# EAGLE design ChromDot_Ring_two_inch (EAGLE 9.1.0)
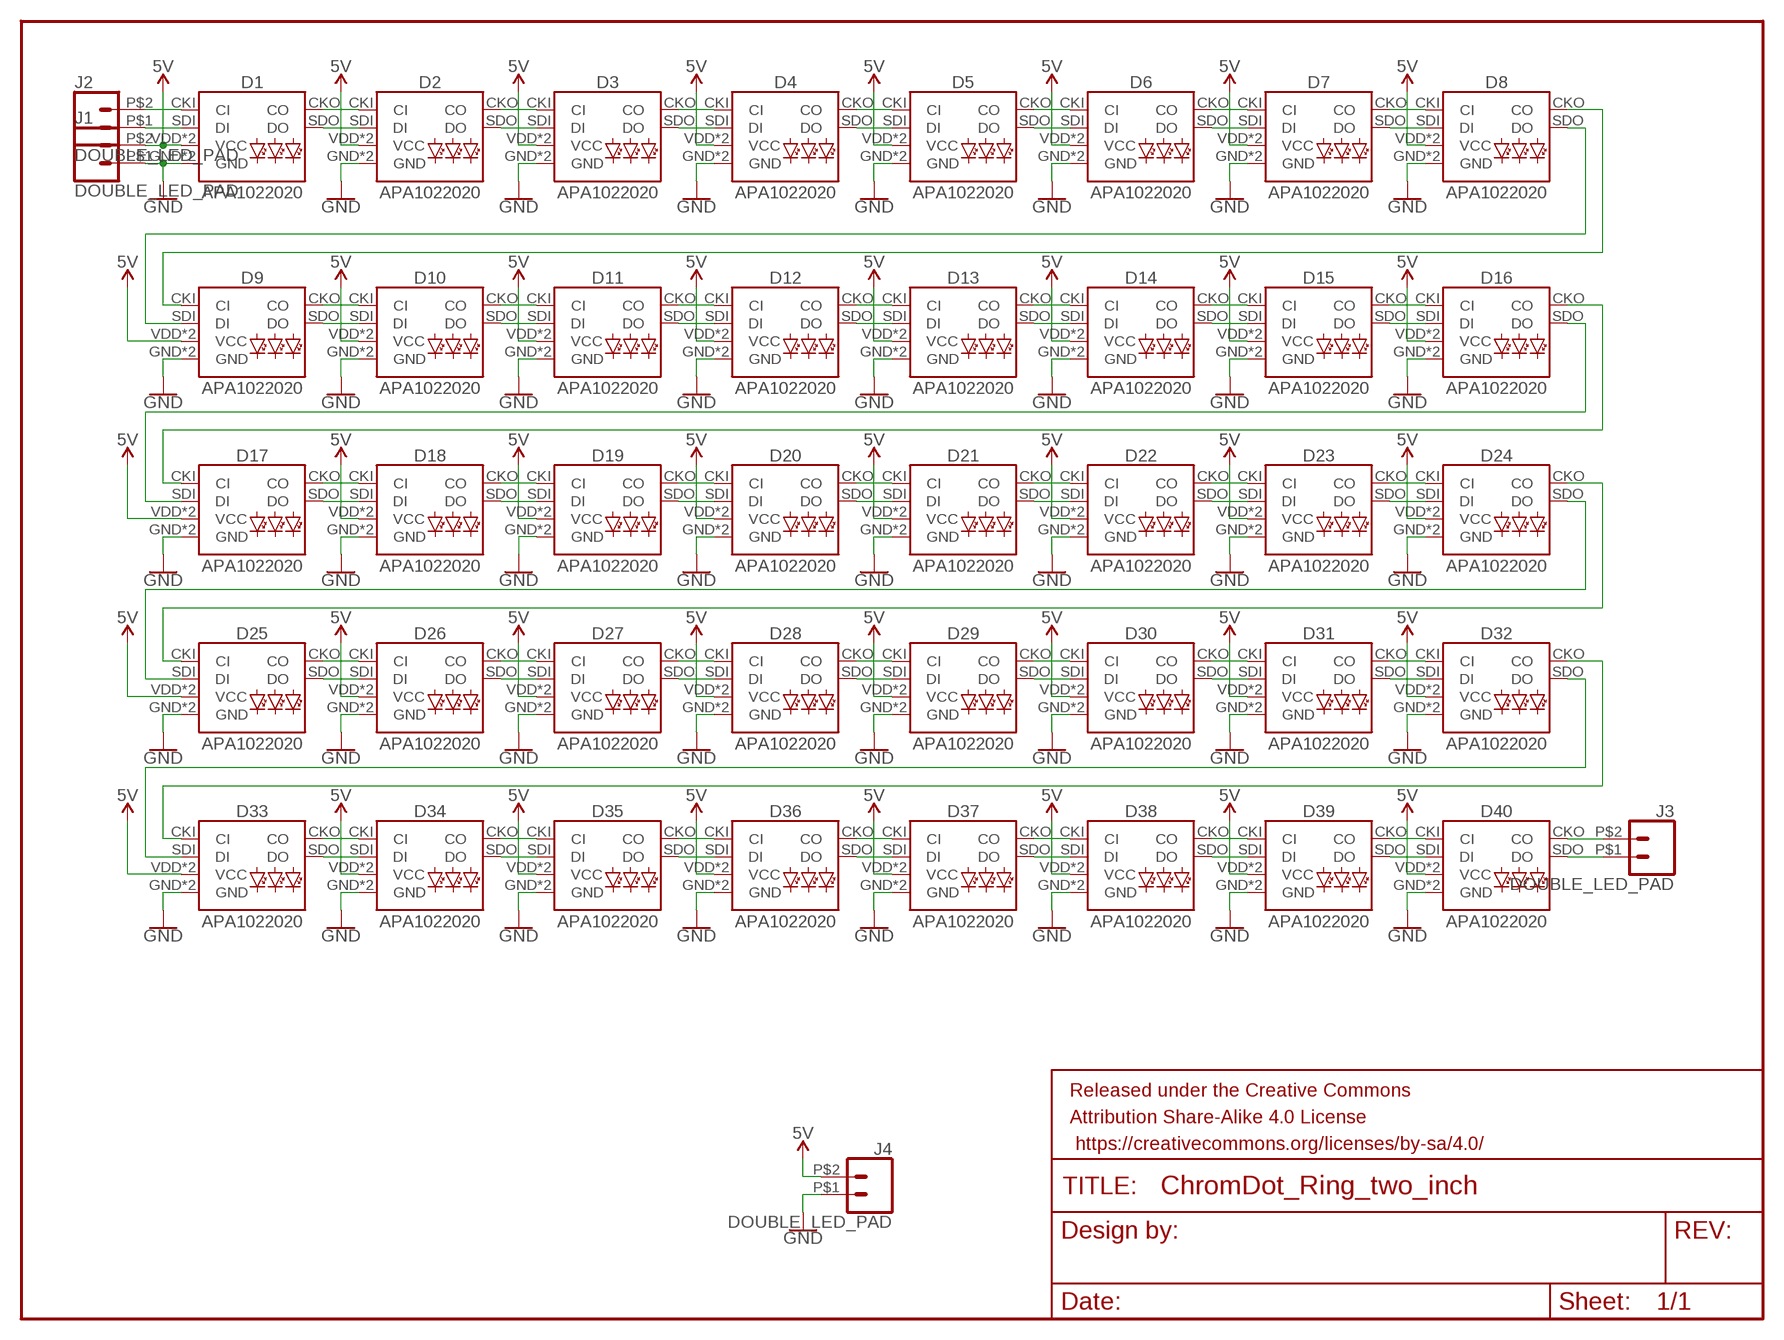
[diagram p0: schematic, sheet 1]

## Parts
D1  APA1022020  [APA102-2020]
D2  APA1022020  [APA102-2020]
D3  APA1022020  [APA102-2020]
D4  APA1022020  [APA102-2020]
D5  APA1022020  [APA102-2020]
D6  APA1022020  [APA102-2020]
D7  APA1022020  [APA102-2020]
D8  APA1022020  [APA102-2020]
D9  APA1022020  [APA102-2020]
D10  APA1022020  [APA102-2020]
D11  APA1022020  [APA102-2020]
D12  APA1022020  [APA102-2020]
D13  APA1022020  [APA102-2020]
D14  APA1022020  [APA102-2020]
D15  APA1022020  [APA102-2020]
D16  APA1022020  [APA102-2020]
D17  APA1022020  [APA102-2020]
D18  APA1022020  [APA102-2020]
D19  APA1022020  [APA102-2020]
D20  APA1022020  [APA102-2020]
D21  APA1022020  [APA102-2020]
D22  APA1022020  [APA102-2020]
D23  APA1022020  [APA102-2020]
D24  APA1022020  [APA102-2020]
D25  APA1022020  [APA102-2020]
D26  APA1022020  [APA102-2020]
D27  APA1022020  [APA102-2020]
D28  APA1022020  [APA102-2020]
D29  APA1022020  [APA102-2020]
D30  APA1022020  [APA102-2020]
D31  APA1022020  [APA102-2020]
D32  APA1022020  [APA102-2020]
D33  APA1022020  [APA102-2020]
D34  APA1022020  [APA102-2020]
D35  APA1022020  [APA102-2020]
D36  APA1022020  [APA102-2020]
D37  APA1022020  [APA102-2020]
D38  APA1022020  [APA102-2020]
D39  APA1022020  [APA102-2020]
D40  APA1022020  [APA102-2020]
FRAME1  FRAME-LETTER  [CREATIVE_COMMONS]
J1  DOUBLE_LED_PAD  [DOUBLELEDPAD]
J2  DOUBLE_LED_PAD  [DOUBLELEDPAD]
J3  DOUBLE_LED_PAD  [DOUBLELEDPAD]
J4  DOUBLE_LED_PAD  [DOUBLELEDPAD]

## Nets
5V: D1.VDD(VCC) D1.VDDPAD(VCC) D2.VDD(VCC) D2.VDDPAD(VCC) D3.VDD(VCC) D3.VDDPAD(VCC) D4.VDD(VCC) D4.VDDPAD(VCC) D5.VDD(VCC) D5.VDDPAD(VCC) D6.VDD(VCC) D6.VDDPAD(VCC) D7.VDD(VCC) D7.VDDPAD(VCC) D8.VDD(VCC) D8.VDDPAD(VCC) D9.VDD(VCC) D9.VDDPAD(VCC) D10.VDD(VCC) D10.VDDPAD(VCC) D11.VDD(VCC) D11.VDDPAD(VCC) D12.VDD(VCC) D12.VDDPAD(VCC) D13.VDD(VCC) D13.VDDPAD(VCC) D14.VDD(VCC) D14.VDDPAD(VCC) D15.VDD(VCC) D15.VDDPAD(VCC) D16.VDD(VCC) D16.VDDPAD(VCC) D17.VDD(VCC) D17.VDDPAD(VCC) D18.VDD(VCC) D18.VDDPAD(VCC) D19.VDD(VCC) D19.VDDPAD(VCC) D20.VDD(VCC) D20.VDDPAD(VCC) D21.VDD(VCC) D21.VDDPAD(VCC) D22.VDD(VCC) D22.VDDPAD(VCC) D23.VDD(VCC) D23.VDDPAD(VCC) D24.VDD(VCC) D24.VDDPAD(VCC) D25.VDD(VCC) D25.VDDPAD(VCC) D26.VDD(VCC) D26.VDDPAD(VCC) D27.VDD(VCC) D27.VDDPAD(VCC) D28.VDD(VCC) D28.VDDPAD(VCC) D29.VDD(VCC) D29.VDDPAD(VCC) D30.VDD(VCC) D30.VDDPAD(VCC) D31.VDD(VCC) D31.VDDPAD(VCC) D32.VDD(VCC) D32.VDDPAD(VCC) D33.VDD(VCC) D33.VDDPAD(VCC) D34.VDD(VCC) D34.VDDPAD(VCC) D35.VDD(VCC) D35.VDDPAD(VCC) D36.VDD(VCC) D36.VDDPAD(VCC) D37.VDD(VCC) D37.VDDPAD(VCC) D38.VDD(VCC) D38.VDDPAD(VCC) D39.VDD(VCC) D39.VDDPAD(VCC) D40.VDD(VCC) D40.VDDPAD(VCC) J1.P$2 J4.P$2
GND: D1.GND D1.GNDPAD(GND) D2.GND D2.GNDPAD(GND) D3.GND D3.GNDPAD(GND) D4.GND D4.GNDPAD(GND) D5.GND D5.GNDPAD(GND) D6.GND D6.GNDPAD(GND) D7.GND D7.GNDPAD(GND) D8.GND D8.GNDPAD(GND) D9.GND D9.GNDPAD(GND) D10.GND D10.GNDPAD(GND) D11.GND D11.GNDPAD(GND) D12.GND D12.GNDPAD(GND) D13.GND D13.GNDPAD(GND) D14.GND D14.GNDPAD(GND) D15.GND D15.GNDPAD(GND) D16.GND D16.GNDPAD(GND) D17.GND D17.GNDPAD(GND) D18.GND D18.GNDPAD(GND) D19.GND D19.GNDPAD(GND) D20.GND D20.GNDPAD(GND) D21.GND D21.GNDPAD(GND) D22.GND D22.GNDPAD(GND) D23.GND D23.GNDPAD(GND) D24.GND D24.GNDPAD(GND) D25.GND D25.GNDPAD(GND) D26.GND D26.GNDPAD(GND) D27.GND D27.GNDPAD(GND) D28.GND D28.GNDPAD(GND) D29.GND D29.GNDPAD(GND) D30.GND D30.GNDPAD(GND) D31.GND D31.GNDPAD(GND) D32.GND D32.GNDPAD(GND) D33.GND D33.GNDPAD(GND) D34.GND D34.GNDPAD(GND) D35.GND D35.GNDPAD(GND) D36.GND D36.GNDPAD(GND) D37.GND D37.GNDPAD(GND) D38.GND D38.GNDPAD(GND) D39.GND D39.GNDPAD(GND) D40.GND D40.GNDPAD(GND) J1.P$1 J4.P$1
N$1: D4.CKO(CO) D5.CKI(CI)
N$2: D1.CKI(CI) J2.P$2
N$3: D1.SDI(DI) J2.P$1
N$4: D1.CKO(CO) D2.CKI(CI)
N$5: D1.SDO(DO) D2.SDI(DI)
N$6: D2.CKO(CO) D3.CKI(CI)
N$7: D2.SDO(DO) D3.SDI(DI)
N$8: D3.CKO(CO) D4.CKI(CI)
N$9: D3.SDO(DO) D4.SDI(DI)
N$10: D4.SDO(DO) D5.SDI(DI)
N$11: D5.CKO(CO) D6.CKI(CI)
N$12: D5.SDO(DO) D6.SDI(DI)
N$13: D6.CKO(CO) D7.CKI(CI)
N$14: D6.SDO(DO) D7.SDI(DI)
N$15: D7.CKO(CO) D8.CKI(CI)
N$16: D7.SDO(DO) D8.SDI(DI)
N$17: D24.CKO(CO) D25.CKI(CI)
N$19: D9.CKO(CO) D10.CKI(CI)
N$20: D9.SDO(DO) D10.SDI(DI)
N$21: D10.CKO(CO) D11.CKI(CI)
N$22: D10.SDO(DO) D11.SDI(DI)
N$23: D11.CKO(CO) D12.CKI(CI)
N$24: D11.SDO(DO) D12.SDI(DI)
N$25: D12.CKO(CO) D13.CKI(CI)
N$26: D12.SDO(DO) D13.SDI(DI)
N$27: D13.CKO(CO) D14.CKI(CI)
N$28: D13.SDO(DO) D14.SDI(DI)
N$29: D14.CKO(CO) D15.CKI(CI)
N$30: D14.SDO(DO) D15.SDI(DI)
N$31: D15.CKO(CO) D16.CKI(CI)
N$32: D15.SDO(DO) D16.SDI(DI)
N$35: D17.CKO(CO) D18.CKI(CI)
N$36: D17.SDO(DO) D18.SDI(DI)
N$37: D18.CKO(CO) D19.CKI(CI)
N$38: D18.SDO(DO) D19.SDI(DI)
N$39: D19.CKO(CO) D20.CKI(CI)
N$40: D19.SDO(DO) D20.SDI(DI)
N$41: D20.CKO(CO) D21.CKI(CI)
N$42: D20.SDO(DO) D21.SDI(DI)
N$43: D16.SDO(DO) D17.SDI(DI)
N$44: D16.CKO(CO) D17.CKI(CI)
N$45: D8.SDO(DO) D9.SDI(DI)
N$47: D24.SDO(DO) D25.SDI(DI)
N$48: D21.CKO(CO) D22.CKI(CI)
N$49: D21.SDO(DO) D22.SDI(DI)
N$50: D22.CKO(CO) D23.CKI(CI)
N$51: D22.SDO(DO) D23.SDI(DI)
N$52: D23.CKO(CO) D24.CKI(CI)
N$53: D23.SDO(DO) D24.SDI(DI)
N$54: D32.SDO(DO) D33.SDI(DI)
N$55: D32.CKO(CO) D33.CKI(CI)
N$56: D25.CKO(CO) D26.CKI(CI)
N$57: D25.SDO(DO) D26.SDI(DI)
N$58: D26.CKO(CO) D27.CKI(CI)
N$59: D26.SDO(DO) D27.SDI(DI)
N$60: D27.CKO(CO) D28.CKI(CI)
N$61: D27.SDO(DO) D28.SDI(DI)
N$62: D28.CKO(CO) D29.CKI(CI)
N$63: D28.SDO(DO) D29.SDI(DI)
N$66: D29.CKO(CO) D30.CKI(CI)
N$67: D29.SDO(DO) D30.SDI(DI)
N$68: D30.CKO(CO) D31.CKI(CI)
N$69: D30.SDO(DO) D31.SDI(DI)
N$70: D31.CKO(CO) D32.CKI(CI)
N$71: D31.SDO(DO) D32.SDI(DI)
N$74: D33.CKO(CO) D34.CKI(CI)
N$75: D33.SDO(DO) D34.SDI(DI)
N$76: D34.CKO(CO) D35.CKI(CI)
N$77: D34.SDO(DO) D35.SDI(DI)
N$78: D35.CKO(CO) D36.CKI(CI)
N$79: D35.SDO(DO) D36.SDI(DI)
N$80: D36.CKO(CO) D37.CKI(CI)
N$81: D36.SDO(DO) D37.SDI(DI)
N$84: D37.CKO(CO) D38.CKI(CI)
N$85: D37.SDO(DO) D38.SDI(DI)
N$86: D38.CKO(CO) D39.CKI(CI)
N$87: D38.SDO(DO) D39.SDI(DI)
N$88: D39.CKO(CO) D40.CKI(CI)
N$89: D39.SDO(DO) D40.SDI(DI)
N$98: D8.CKO(CO) D9.CKI(CI)
N$133: D40.CKO(CO) J3.P$2
N$134: D40.SDO(DO) J3.P$1

## Library data of the parts
D1-D40 = SparkFun-LED:APA102: APA102 Addressable RGB LED Used in manufacturing of various products at SparkFun Packages: 5050 2020 SparkFun Products: SparkFun Lumenati Boards <https://www.sparkfun.com/categories/405>; PROD_ID: DIO-13883
FRAME1 = SparkFun-Aesthetics:FRAME-LETTER: Schematic Frame - Letter Standard 8.5x11 US Letter frame
J1-J4 = Andy:DOUBLE_LED_PAD

## Board
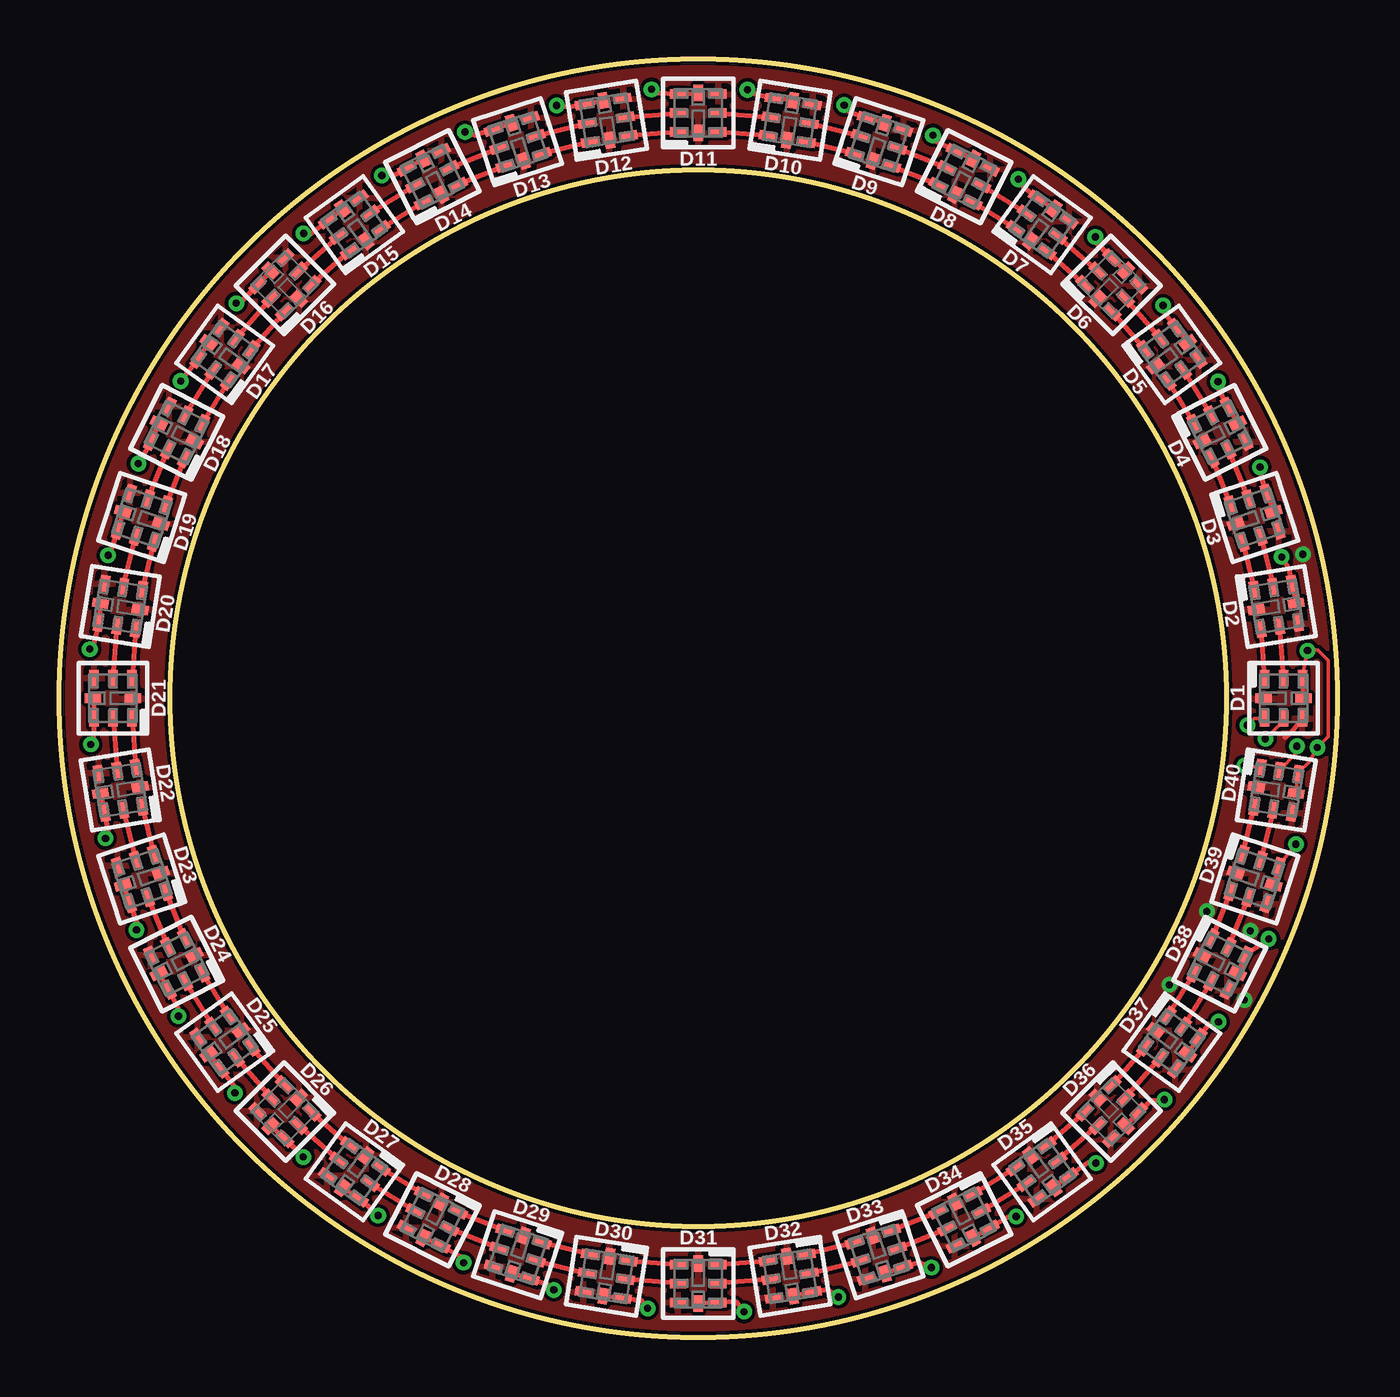
[diagram p1: board, top side]
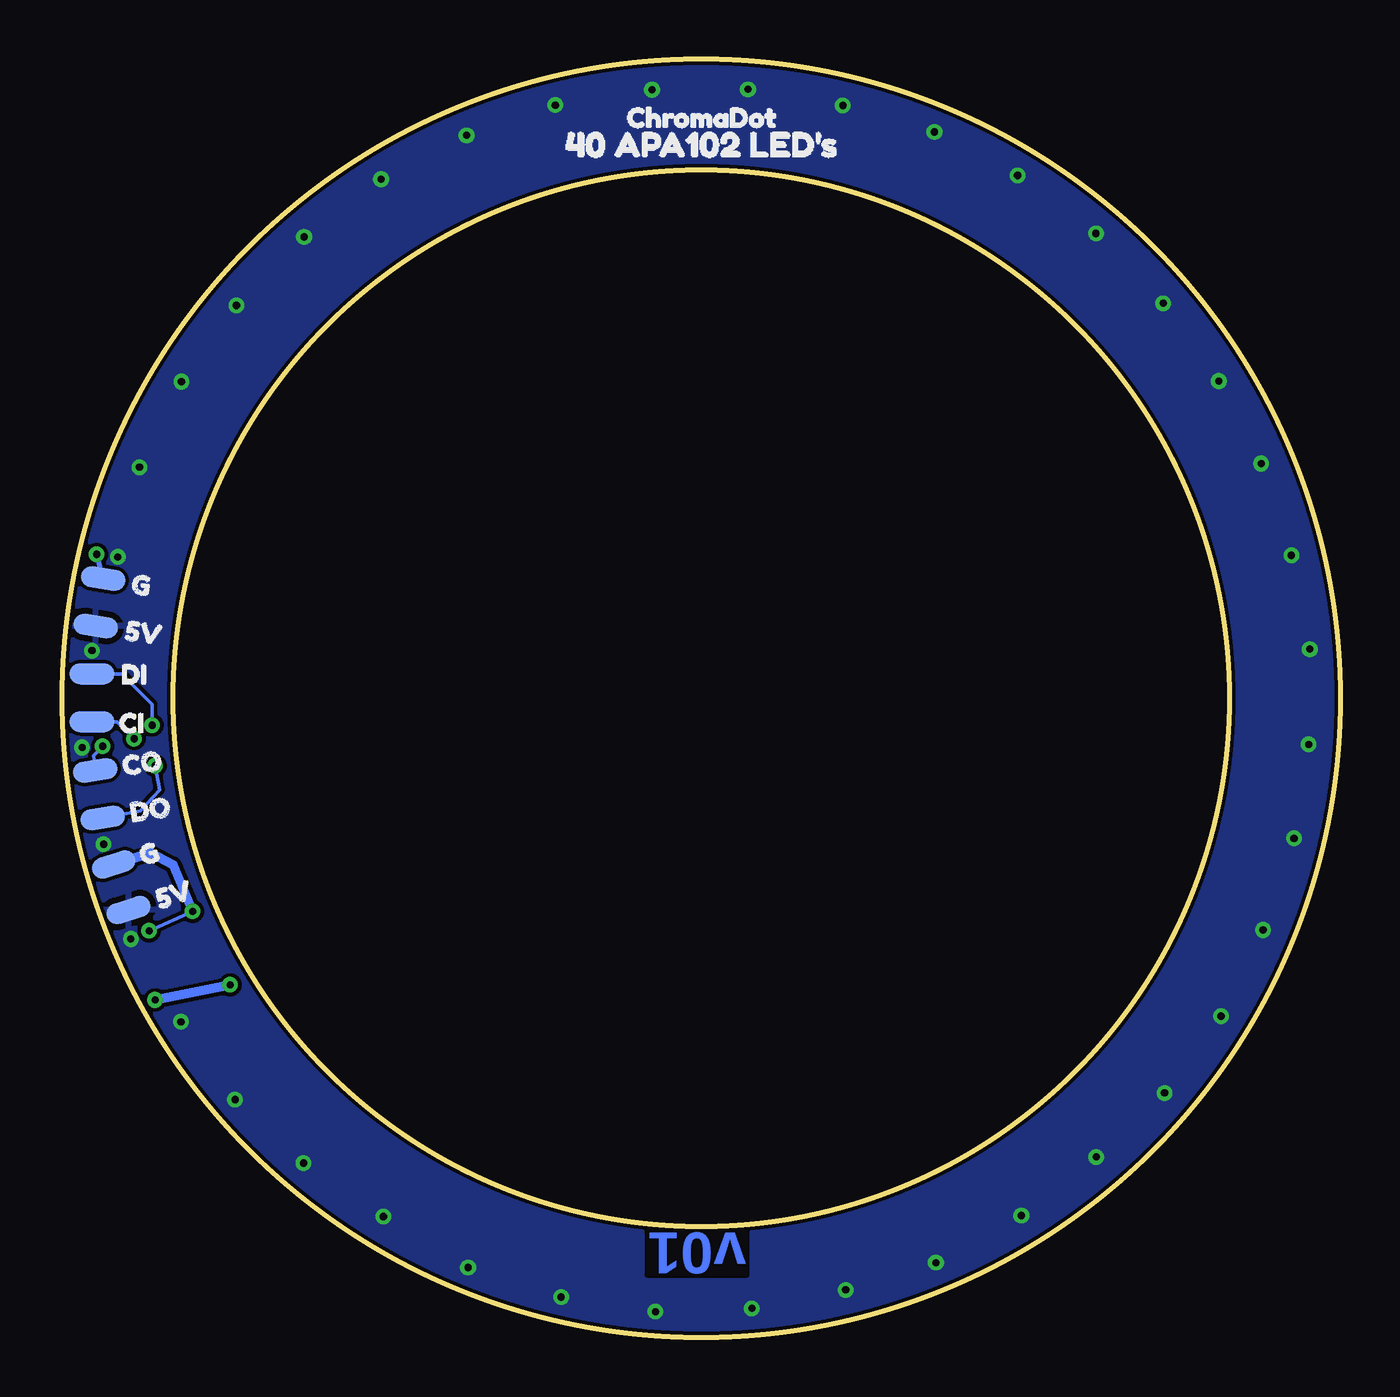
[diagram p2: board, bottom side, seen from below]

Size 54.1 x 54.1 mm. Coordinates in mm from the lower left corner, seen from the top.
Outline: circle at 27.05,27.05 radius 27.05
Outline: circle at 27.05,27.05 radius 22.35
Copper layers (1*16): Top 0.035mm / dielectric 1.5mm / Bottom 0.035mm
Design rules "SparkFun-2-layer-PCBWay-LIMIT": minimum track width 6mil, minimum drill 0.3mm, track to track 6mil, track to pad 6mil, pad to pad 6mil, via to via 6mil, smd to smd 6mil, copper to edge 6mil, drill to drill 6mil, minimum pad ring 7mil, minimum via ring 7mil, stop-mask expansion 4mil, vias tented up to drill 25mil, thermal gap 10mil

### Footprints (pad centres in the part's own frame; a part is rotated, then mirrored left to right if it is on the bottom)
APA102-2020 = smd 0.7 x 0.4: CKI -0.85,0; CKO 0.85,0; GND -0.85,-0.8; SDI -0.85,0.8; SDO 0.85,0.8; VDD 0.85,-0.8 | smd 0.4 x 0.7: GNDPAD 0,0.85; VDDPAD 0,-0.85
DOUBLELEDPAD = smd 0.889 x 1.905: P$1 -1.016,0; P$2 1.016,0

### Placement (x,y rotation side)
D1  51.82,27.05 90 top
D2  51.51,30.94 99 top
D3  50.6,34.7 108 top
D4  49.12,38.3 117 top
D5  47.09,41.61 126 top
D6  44.55,44.55 135 top
D7  41.61,47.09 144 top
D8  38.3,49.12 153 top
D9  34.7,50.6 162 top
D10  30.94,51.51 171 top
D11  27.05,51.82 180 top
D12  23.16,51.51 189 top
D13  19.41,50.6 198 top
D14  15.8,49.12 207 top
D15  12.5,47.09 216 top
D16  9.55,44.55 225 top
D17  7.01,41.61 234 top
D18  4.98,38.3 243 top
D19  3.51,34.7 252 top
D20  2.59,30.94 261 top
D21  2.29,27.05 270 top
D22  2.59,23.16 279 top
D23  3.51,19.41 288 top
D24  4.98,15.8 297 top
D25  7.01,12.5 306 top
D26  9.55,9.55 315 top
D27  12.5,7.01 324 top
D28  15.8,4.98 333 top
D29  19.41,3.51 342 top
D30  23.16,2.59 351 top
D31  27.05,2.29 0 top
D32  30.94,2.59 9 top
D33  34.7,3.51 18 top
D34  38.3,4.98 27 top
D35  41.61,7.01 36 top
D36  44.55,9.55 45 top
D37  47.09,12.5 54 top
D38  49.12,15.8 63 top
D39  50.6,19.41 72 top
D40  51.51,23.16 81 top
FRAME1  -35.18,-11.05 0 top  (outside the outline)
J1  52.51,31.11 261 bottom
J2  52.83,27.06 270 bottom
J3  52.54,22.99 99 bottom
J4  51.6,19.05 288 bottom
U$1  [CHROMADOT5]  30.92,51.63 0 bottom
U$3  [5V6]  50.8,18.29 18 bottom
U$4  [5V6]  52.13,30.04 352 bottom
U$5  [G4]  51.88,32 352 bottom
U$6  [G4]  51.5,20.13 18 bottom
U$7  [DO3]  51.94,22.1 9 bottom
U$8  [CO1]  52.26,24.07 9 bottom
U$9  [CI6]  52.43,26.01 0 bottom
U$10  [DI4]  52.32,28.07 0 bottom
U$11  [40_APA102_LED#S1]  33.72,50.48 0 bottom

### Tracks (layer width: path | path; a pad name or v marks a point on that pad's centre or on a via)
5V  (via drill 0.3)
  Top 0.152: v52.34,20.87 D39.VDD | D40.VDDPAD D40.VDD 52.92,24.36 v53.25,24.97 53.72,25.44 53.72,28.64 53.28,29.08 52.85,29.08 v52.84,29.07 D1.VDD
  Top 0.203: D30.VDDPAD D30.VDD 24.63,1.57 v24.91,1.23 | D29.VDDPAD D29.VDD 20.88,2.16 v20.94,2.01 | D28.VDDPAD D28.VDD 17.01,3.42 v17.12,3.16 | D27.VDDPAD D27.VDD 13.49,5.23 v13.5,5.16 | D26.VDD D26.VDDPAD | D25.VDDPAD D25.VDD 7.46,10.58 v7.44,10.35 | D24.VDDPAD D24.VDD 5.11,13.8 v5.05,13.6 | D23.VDDPAD D23.VDD 3.34,17.35 v3.28,17.25 | D22.VDDPAD D22.VDD 2.08,21.29 v1.97,21.12 | D21.VDDPAD D21.VDD 1.44,25.22 v1.34,25.1 | D20.VDDPAD D20.VDD 1.45,29.28 v1.29,29.13 | D19.VDDPAD D19.VDD 2.12,33.13 v2.08,33.1 | D8.VDDPAD D8.VDD 37.1,50.64 v36.98,50.87 | D9.VDDPAD D9.VDD 33.42,51.88 v33.23,52.15 | D7.VDDPAD D7.VDD 40.66,48.81 v40.6,49.02 | D6.VDDPAD D6.VDD 43.84,46.39 v43.86,46.58 | D5.VDDPAD D5.VDD 46.7,43.45 v46.72,43.68 | D4.VDDPAD D4.VDD 49.02,40.25 v49.05,40.45 | D3.VDDPAD D3.VDD 50.8,36.76 v50.83,36.83 | D2.VDDPAD D2.VDD 52.07,32.51 v51.74,33.03 | D1.VDD D1.VDDPAD | D39.VDD D39.VDDPAD | D38.VDDPAD D38.VDD v51.19,16.87 | D37.VDDPAD D37.VDD 48.68,13.25 v49.07,13.36 | D36.VDDPAD D36.VDD 46.23,10.03 v46.78,10.06 | D35.VDDPAD D35.VDD 43.55,7.41 v43.88,7.38 | D34.VDDPAD D34.VDD 40.29,5.2 v40.5,5.12 | D33.VDDPAD D33.VDD 36.39,3.17 v36.92,2.96 | D32.VDDPAD D32.VDD 32.51,2.03 v32.98,1.71 | v29.13,52.81 29.28,52.65 D10.VDD D10.VDDPAD | v25.07,52.82 25.25,52.65 D11.VDD D11.VDDPAD | D12.VDDPAD D12.VDD 21.59,52.07 v21.06,52.14 | D13.VDDPAD D13.VDD 17.59,50.87 v17.18,51.02 | D14.VDDPAD D14.VDD 14.22,49.21 v13.66,49.18 | D15.VDDPAD D15.VDD 10.65,46.7 v10.35,46.72 | D16.VDDPAD D16.VDD 7.65,43.78 v7.5,43.77 | D17.VDDPAD D17.VDD v5.15,40.48 v5.15,40.47 | D18.VDDPAD D18.VDD 3.42,37.02 v3.35,36.98 | D31.VDDPAD D31.VDD 28.64,1.52 v28.99,1.09
  Top 0.203: v10.33,7.64 D26.VDD | D26.VDD
  pour Bottom: 27.05,54.1 arc-90 54.1,27.05 arc-270 26.99,54.1 arc-179
GND  (via drill 0.3)
  Top 0.203: D1.GND 52.13,25.59 51.88,25.4
  Bottom 0.152: v48.58,18.03 v50.42,17.21
  Bottom 0.203: J1.P$1 v52.64,33.15
  Bottom 0.406: J4.P$1 50.36,20.51 49.4,20 v48.58,18.03 | v50.16,14.29 v46.99,14.92
  pour Top: 27.05,54.1 arc90 0,27.05 arc270 27.11,54.1 arc179
N$1
  Top 0.203: D5.CKI D4.CKO
N$2  (via drill 0.3)
  Top 0.152: D1.CKI 51.82,26.1 v51.05,25.34
  Bottom 0.152: J2.P$2 51.77,26.05 v51.05,25.34
N$3  (via drill 0.3)
  Top 0.152: v50.29,25.91 50.58,26.2 D1.SDI
  Bottom 0.152: v50.29,25.91 50.29,26.8 51.57,28.08 J2.P$1
N$4
  Top 0.203: D2.CKI D1.CKO
N$5
  Top 0.203: D2.SDI D1.SDO
N$6
  Top 0.203: D3.CKI D2.CKO
N$7
  Top 0.203: D3.SDI D2.SDO
N$8
  Top 0.203: D3.CKO D4.CKI
N$9
  Top 0.203: D4.SDI D3.SDO
N$10
  Top 0.203: D5.SDI D4.SDO
N$11
  Top 0.203: D6.CKI D5.CKO
N$12
  Top 0.203: D5.SDO D6.SDI
N$13
  Top 0.203: D7.CKI D6.CKO
N$14
  Top 0.203: D7.SDI D6.SDO
N$15
  Top 0.203: D8.CKI D7.CKO
N$16
  Top 0.203: D7.SDO D8.SDI
N$17
  Top 0.203: D25.CKI D24.CKO
N$19
  Top 0.203: D10.CKI D9.CKO
N$20
  Top 0.203: D9.SDO D10.SDI
N$21
  Top 0.203: D11.CKI D10.CKO
N$22
  Top 0.203: D10.SDO D11.SDI
N$23
  Top 0.203: D12.CKI D11.CKO
N$24
  Top 0.203: D11.SDO D12.SDI
N$25
  Top 0.203: D13.CKI D12.CKO
N$26
  Top 0.203: D12.SDO D13.SDI
N$27
  Top 0.203: D14.CKI D13.CKO
N$28
  Top 0.203: D13.SDO D14.SDI
N$29
  Top 0.203: D15.CKI D14.CKO
N$30
  Top 0.203: D14.SDO D15.SDI
N$31
  Top 0.203: D16.CKI D15.CKO
N$32
  Top 0.203: D15.SDO D16.SDI
N$35
  Top 0.203: D18.CKI D17.CKO
N$36
  Top 0.203: D17.SDO D18.SDI
N$37
  Top 0.203: D19.CKI D18.CKO
N$38
  Top 0.203: D18.SDO D19.SDI
N$39
  Top 0.203: D20.CKI D19.CKO
N$40
  Top 0.203: D19.SDO D20.SDI
N$41
  Top 0.203: D21.CKI D20.CKO
N$42
  Top 0.203: D20.SDO D21.SDI
N$43
  Top 0.203: D16.SDO D17.SDI
N$44
  Top 0.203: D17.CKI D16.CKO
N$45
  Top 0.203: D9.SDI D8.SDO
N$47
  Top 0.203: D24.SDO D25.SDI
N$48
  Top 0.203: D21.CKO D22.CKI
N$49
  Top 0.203: D21.SDO D22.SDI
N$50
  Top 0.203: D22.CKO D23.CKI
N$51
  Top 0.203: D22.SDO D23.SDI
N$52
  Top 0.203: D23.CKO D24.CKI
N$53
  Top 0.203: D24.SDI D23.SDO
N$54
  Top 0.203: D33.SDI D32.SDO
N$55
  Top 0.203: D32.CKO D33.CKI
N$56
  Top 0.203: D25.CKO D26.CKI
N$57
  Top 0.203: D26.SDI D25.SDO
N$58
  Top 0.203: D27.CKI D26.CKO
N$59
  Top 0.203: D26.SDO D27.SDI
N$60
  Top 0.203: D28.CKI D27.CKO
N$61
  Top 0.203: D27.SDO D28.SDI
N$62
  Top 0.203: D29.CKI D28.CKO
N$63
  Top 0.203: D28.SDO D29.SDI
N$66
  Top 0.203: D29.CKO D30.CKI
N$67
  Top 0.203: D30.SDI D29.SDO
N$68
  Top 0.203: D31.CKI D30.CKO
N$69
  Top 0.203: D30.SDO D31.SDI
N$70
  Top 0.203: D32.CKI D31.CKO
N$71
  Top 0.203: D31.SDO D32.SDI
N$74
  Top 0.203: D33.CKO D34.CKI
N$75
  Top 0.203: D34.SDI D33.SDO
N$76
  Top 0.203: D34.CKO D35.CKI
N$77
  Top 0.203: D35.SDI D34.SDO
N$78
  Top 0.203: D36.CKI D35.CKO
N$79
  Top 0.203: D36.SDI D35.SDO
N$80
  Top 0.203: D36.CKO D37.CKI
N$81
  Top 0.203: D37.SDI D36.SDO
N$84
  Top 0.203: D38.CKI D37.CKO
N$85
  Top 0.203: D38.SDI D37.SDO
N$86
  Top 0.203: D38.CKO D39.CKI
N$87
  Top 0.203: D39.SDI D38.SDO
N$88
  Top 0.203: D40.CKI D39.CKO
N$89
  Top 0.203: D39.SDO D40.SDI
N$98
  Top 0.203: D9.CKI D8.CKO
N$133  (via drill 0.3)
  Top 0.152: D40.CKO 52.39,24.75 v52.39,25.02
  Bottom 0.152: J3.P$2 52.77,24.64 v52.39,25.02
N$134  (via drill 0.3)
  Top 0.152: v50.16,24.19 D40.SDO
  Bottom 0.152: J3.P$1 50.8,22.29 49.97,23.18 v50.16,24.19

### Text on the board
Bottom: v01